# EAGLE design H1AR0 (EAGLE 9.6.1)

## Sheet 1 of 2
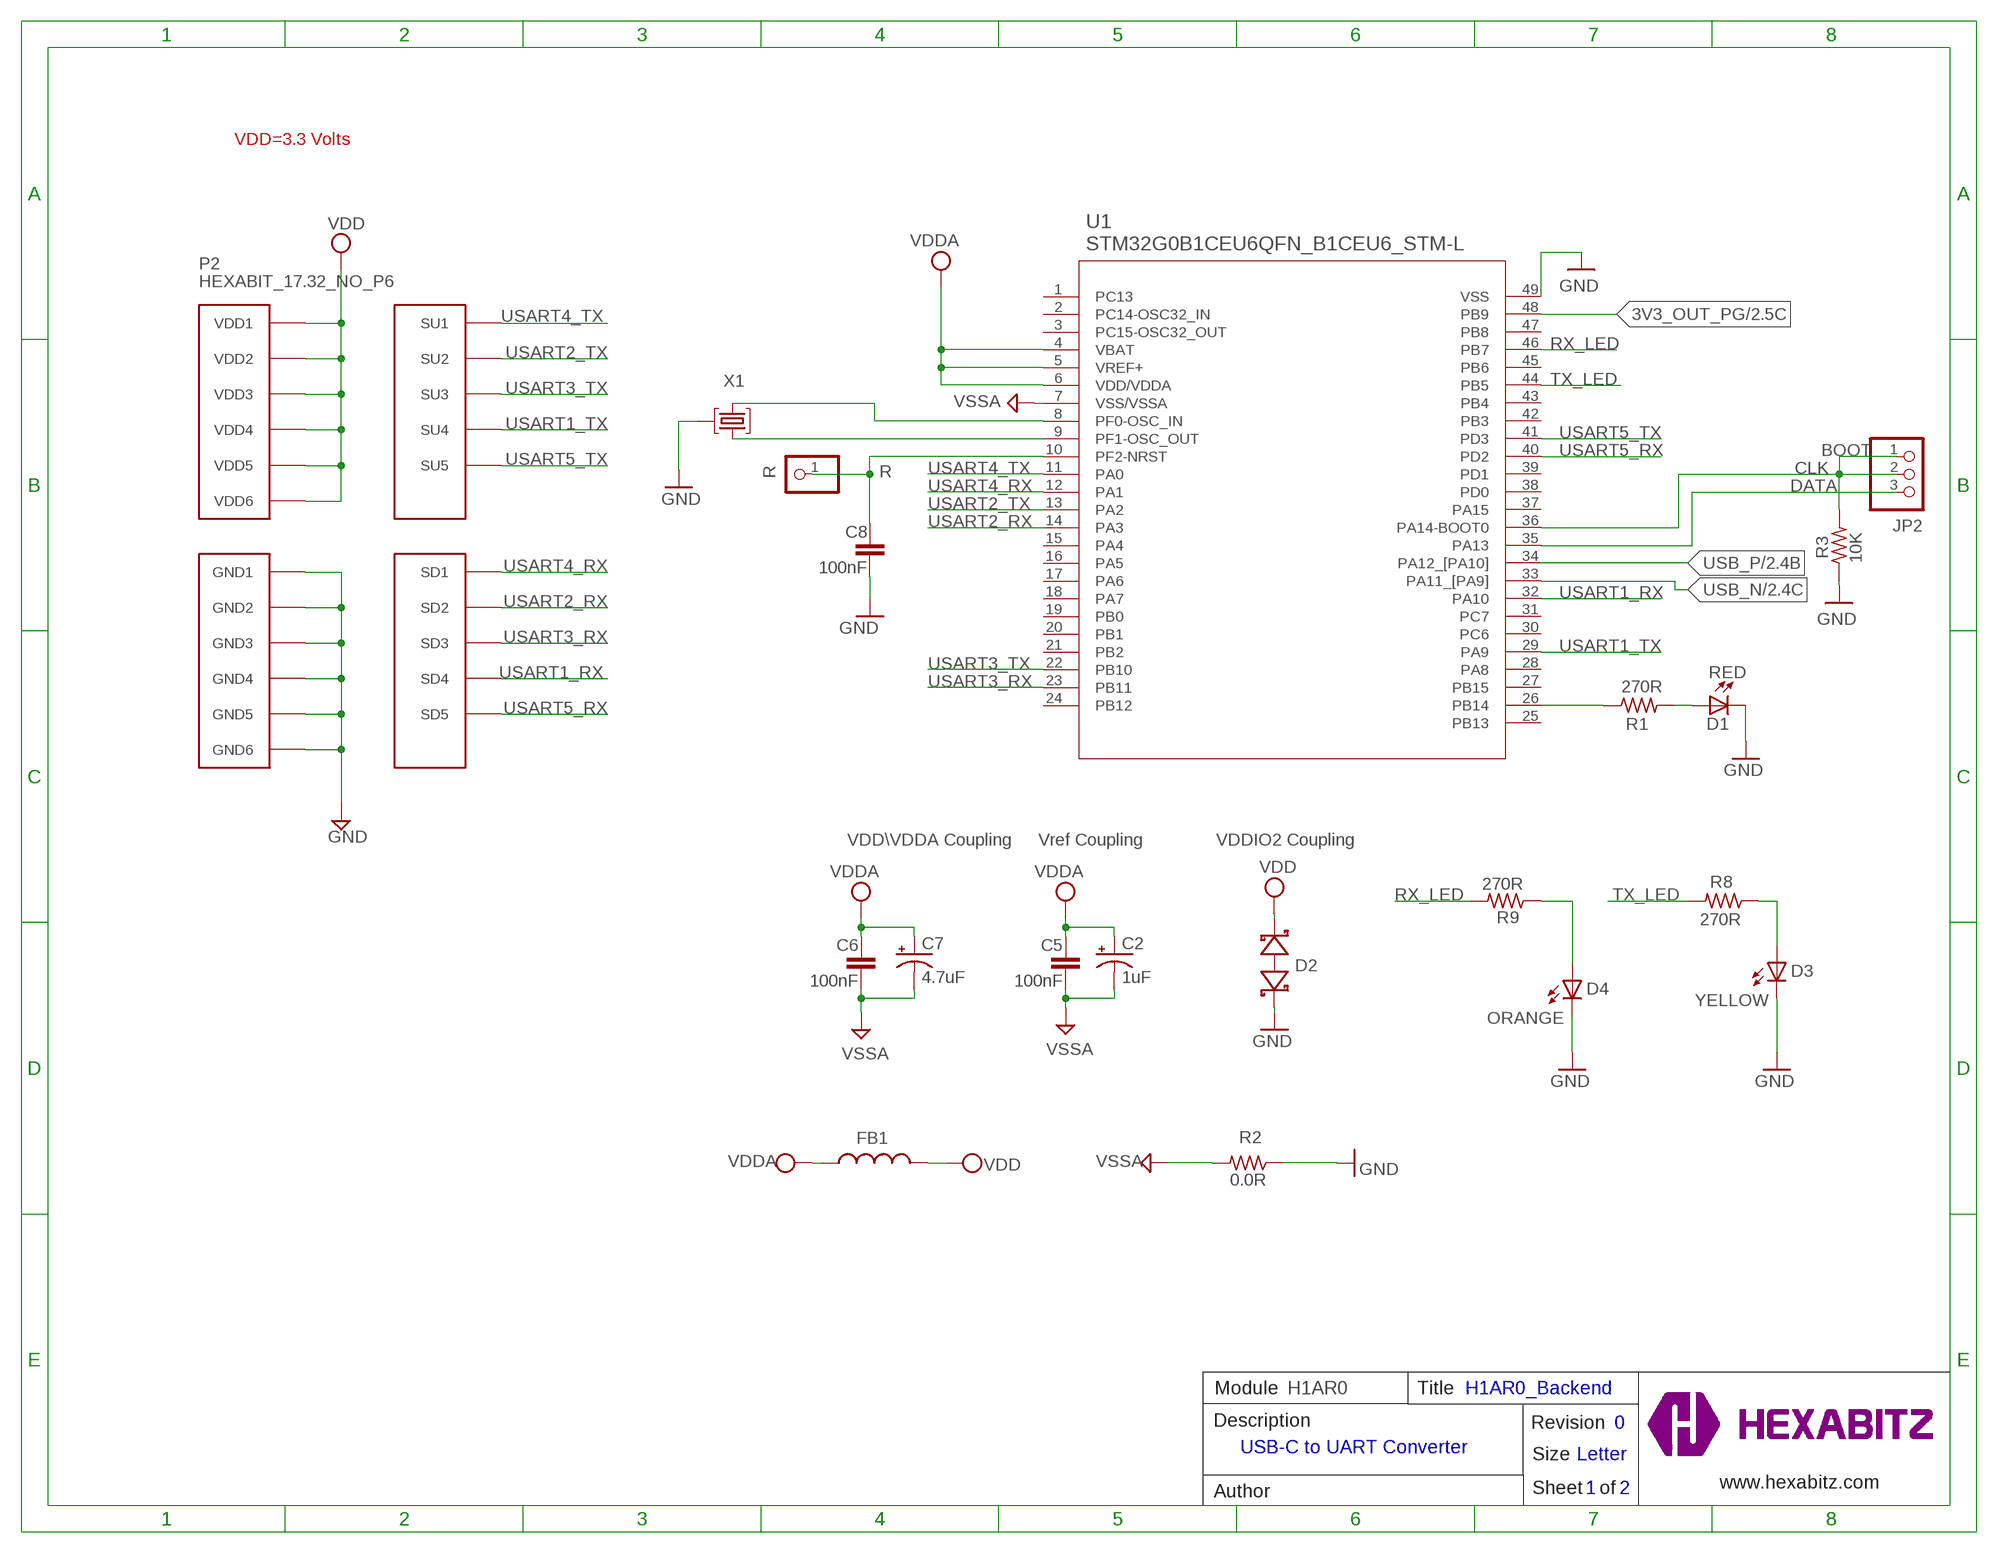
[diagram p0: schematic, sheet 1]

### Parts
C2  1uF  C-0805-POL  [C-0805-POL]
C5  100nF  C-0603  [C-0603]
C6  100nF  C-0603  [C-0603]
C7  4.7uF  C-0805-POL  [C-0805-POL]
C8  100nF  C-0603  [C-0603]
D1  RED  VLMS1300-GS08  [VLMS1300-GS08]
D2  BOURNS_CDSOD323-T03SCBOURNS_CDSOD323-T03SC_0_0  [BOURNS_CDSOD323-T03SC_0]
D3  YELLOW  VLMS1300-GS08  [VLMS1300-GS08]
D4  ORANGE  VLMS1300-GS08  [VLMS1300-GS08]
FB1  FB-TDK_MMZ1608Y300B  [FB-TDK_MMZ1608Y300B]
JP2  PINHD-1X3  [1X03]
P2  HEXABIT_17.32_NO_P6  [HEXABIT_17.32_NO_P6]
R  R  PINHD-1X1  [1X01]
R1  270R  R-0603  [R-0603]
R2  0.0R  R-0603  [R-0603]
R3  10K  R-0603  [R-0603]
R8  270R  R-0603  [R-0603]
R9  270R  R-0603  [R-0603]
TRIMBLE-LOGO1  HEXA-LOGO  [HEXA-LOGO]
U1  STM32G0B1CEU6QFN_B1CEU6_STM-L  [QFN_B1CEU6_STM-L]
X1  XTALL_CSTCE8M00G52  [XTALL_CSTCE8M00G52]

### Nets
3V3_OUT_PG: U1.48(PB9) ; also sheet 2
CLK: JP2.1 JP2.2 R3.2 U1.36(PA14-BOOT0)
DATA: JP2.3 U1.35(PA13)
GND: C8.2 D1.C D2.1(A) D3.C D4.C P2.PAD_PD7(GND1) P2.PAD_PD8(GND2) P2.PAD_PD9(GND3) P2.PAD_PD10(GND4) P2.PAD_PD11(GND5) P2.PAD_PD12(GND6) R2.1 R3.1 U1.49(VSS) X1.P$2 ; also sheet 2
N$2: R1.1 U1.26(PB14)
N$3: D1.A R1.2
N$4: C8.1 R.1 U1.10(PF2-NRST)
N$5: U1.9(PF1-OSC_OUT) X1.P$1
N$6: U1.8(PF0-OSC_IN) X1.P$3
N$12: D4.A R9.1
N$13: D3.A R8.1
RX_LED: R9.2 U1.46(PB7)
TX_LED: R8.2 U1.44(PB5)
USART1_RX: P2.PAD_PD4(SD4) U1.32(PA10)
USART1_TX: P2.PAD_PU4(SU4) U1.29(PA9)
USART2_RX: P2.PAD_PD2(SD2) U1.14(PA3)
USART2_TX: P2.PAD_PU2(SU2) U1.13(PA2)
USART3_RX: P2.PAD_PD3(SD3) U1.23(PB11)
USART3_TX: P2.PAD_PU3(SU3) U1.22(PB10)
USART4_RX: P2.PAD_PD1(SD1) U1.12(PA1)
USART4_TX: P2.PAD_PU1(SU1) U1.11(PA0)
USART5_RX: P2.PAD_PD5(SD5) U1.40(PD2)
USART5_TX: P2.PAD_PU5(SU5) U1.41(PD3)
USB_N: U1.33(PA11_[PA9]) ; also sheet 2
USB_P: U1.34(PA12_[PA10]) ; also sheet 2
VDD: D2.2(C) FB1.2 P2.PAD_PU7(VDD1) P2.PAD_PU8(VDD2) P2.PAD_PU9(VDD3) P2.PAD_PU10(VDD4) P2.PAD_PU11(VDD5) P2.PAD_PU12(VDD6) ; also sheet 2
VDDA: C2.1(+) C5.1 C6.1 C7.1(+) FB1.1 U1.4(VBAT) U1.5(VREF+) U1.6(VDD/VDDA)
VSSA: C2.2(-) C5.2 C6.2 C7.2(-) R2.2 U1.7(VSS/VSSA)
Unconnected: U1.1(PC13) U1.2(PC14-OSC32_IN) U1.3(PC15-OSC32_OUT) U1.15(PA4) U1.16(PA5) U1.17(PA6) U1.18(PA7) U1.19(PB0) U1.20(PB1) U1.21(PB2) U1.24(PB12) U1.25(PB13) U1.27(PB15) U1.28(PA8) U1.30(PC6) U1.31(PC7) U1.37(PA15) U1.38(PD0) U1.39(PD1) U1.42(PB3) U1.43(PB4) U1.45(PB6) U1.47(PB8)

### Notes on the sheet
- VDD=3.3 Volts
- BOOT
- VDD\VDDA Coupling | Vref Coupling | VDDIO2 Coupling
- Module | H1AR0 | Title | H1AR0_Backend
- Description | Revision | 0
- USB-C to UART Converter
- Size | Letter
- www.hexabitz.com
- Author | Sheet   of | 1 | 2
- C:/Users/Admin/Desktop/logodraft.bmp

## Sheet 2 of 2
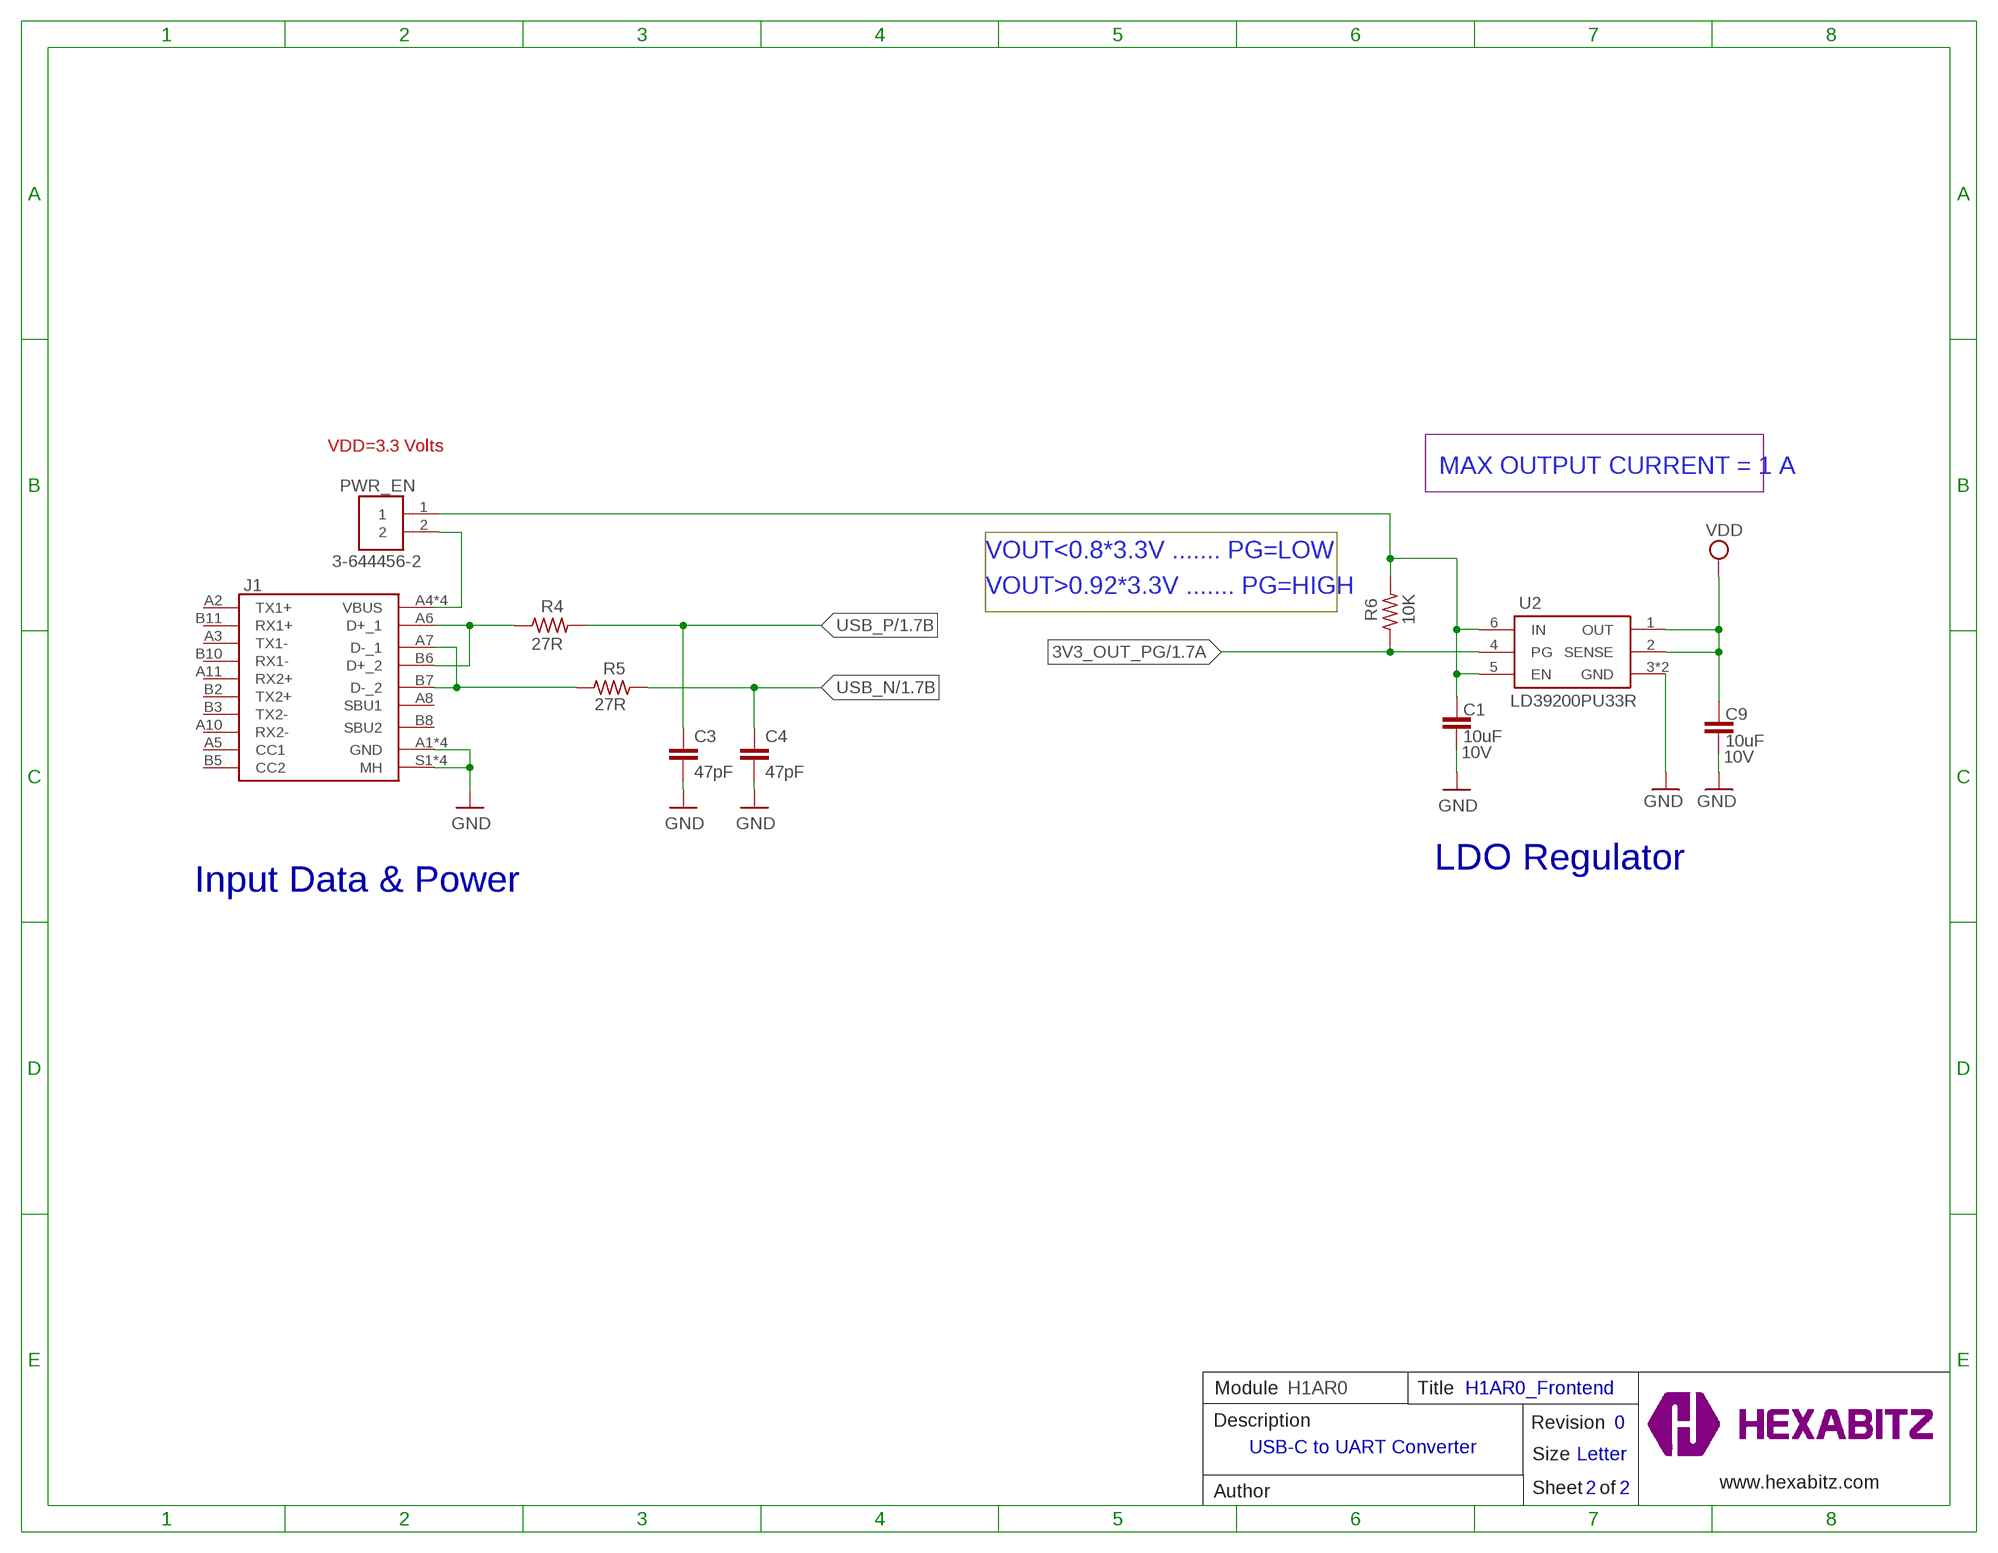
[diagram p1: schematic, sheet 2]

### Parts
C1  10uF  C-0805  [C-0805]
C3  47pF  C-0603  [C-0603]
C4  47pF  C-0603  [C-0603]
C9  10uF  C-0805  [C-0805]
J1  12401610E4#2A12401610E42A  [AMPHENOL_12401610E4_2A]
PWR_EN  3-644456-2  [TE_3-644456-2]
R4  27R  R-0603  [R-0603]
R5  27R  R-0603  [R-0603]
R6  10K  R-0603  [R-0603]
U2  LD39200PU33R  [SON95P300X300X100-7N]

### Nets
3V3_OUT_PG: R6.1 U2.4(PG) ; also sheet 1
D_N: J1.A7(D-_1) J1.B7(D-_2) R5.2
D_P: J1.A6(D+_1) J1.B6(D+_2) R4.1
GND: C1.1 C3.2 C4.2 C9.1 J1.A1(GND) J1.A12(GND) J1.B1(GND) J1.B12(GND) J1.S1(MH) J1.S2(MH) J1.S3(MH) J1.S4(MH) U2.3(GND) U2.7(GND) ; also sheet 1
N$1: C1.2 PWR_EN.1 R6.2 U2.5(EN) U2.6(IN)
N$8: J1.A4(VBUS) J1.A9(VBUS) J1.B4(VBUS) J1.B9(VBUS) PWR_EN.2
USB_N: C4.1 R5.1 ; also sheet 1
USB_P: C3.1 R4.2 ; also sheet 1
VDD: C9.2 U2.1(OUT) U2.2(SENSE) ; also sheet 1
Unconnected: J1.A2(TX1+) J1.A3(TX1-) J1.A5(CC1) J1.A8(SBU1) J1.A10(RX2-) J1.A11(RX2+) J1.B2(TX2+) J1.B3(TX2-) J1.B5(CC2) J1.B8(SBU2) J1.B10(RX1-) J1.B11(RX1+)

### Notes on the sheet
- VDD=3.3 Volts
- MAX OUTPUT CURRENT = 1 A
- VOUT<0.8*3.3V ....... PG=LOW
- VOUT>0.92*3.3V ....... PG=HIGH
- LDO Regulator
- Input Data & Power
- Module | H1AR0 | Title | H1AR0_Frontend
- Description | Revision | 0
- USB-C to UART Converter
- Size | Letter
- www.hexabitz.com
- Author | Sheet   of | 2 | 2

## Library data of the parts
C1 C9 = HEXABITZ_RCLS:C-0805: CAP CER 10% X7R 0805; MPN: GRM187R61A226ME15; VOLTAGE_RATING: 10V
C2 C7 = HEXABITZ_RCLS:C-0805-POL: Cap Tant Solid SMD 2012
C3-C6 C8 = HEXABITZ_RCLS:C-0603: CAP CER 10% X7R 0603
D1 = Hexabitz:VLMS1300-GS08: Red 0603 130° Clear 54 mcd 2 V Surface Mount ChipLED ; Octopart Url : http://octopart.com/vlms1300-gs08-vishay-21709201; MFN: Vishay; MPN: VLMS1300-GS08; OCTOPART_URL: https://octopart.com/vlms1300-gs08-vishay-21709201?r=sp&s=_gcP4_q8T1SC6PJQPTQ9yA
D2 = HEXABITZ_RCLS:BOURNS_CDSOD323-T03SC: CDSOD323-TxxSC - TVS Diode Series; DESCRIPTION: Dio Tvs Vwm 03V 500W Bidir Sod323 / Tape & Reel - 7" Reel; MFN: Bourns; MPN: CDSOD323-T03SC; OCTOPART_URL: https://octopart.com/cdsod323-t03sc-bourns-10487153?r=sp
D3 D4 = HEXABITZ_USER_INTERFACE_PARTS:VLMS1300-GS08: Red 0603 130° Clear 54 mcd 2 V Surface Mount ChipLED ; Octopart Url : http://octopart.com/vlms1300-gs08-vishay-21709201; MFN: Vishay; MPN: VLMS1300-GS08; OCTOPART_URL: https://octopart.com/vlms1300-gs08-vishay-21709201?r=sp&s=_gcP4_q8T1SC6PJQPTQ9yA; VALUE: RED
FB1 = HEXABITZ_RCLS:FB-TDK_MMZ1608Y300B: Ferrite Beads Multi-Layer 30Ohm 25% 100MHz 1.5A 50mOhm DCR 0603; MFN: TDK; MPN: MMZ1608Y300B; OCTOPART_URL: https://octopart.com/mmz1608y300b-tdk-368280?r=sp&s=cd9_2ZEqQ9q9UNBuQgHAiA
J1 = HEXABITZ_CONNECTION_PARTS:12401610E4#2A: USB3.2 GEN2, Type C, Top mount, CH 1.58mm, Dual Row SMT Source: Datasheet <https://cdn.amphenol-cs.com/media/wysiwyg/files/drawing/c12401610_c.pdf>
JP2 = pinhead:PINHD-1X3: PIN HEADER
P2 = hexabitz_connectors:HEXABIT_?_NO_P6: Hexabitz Hexagon Module Connector Hexagon side length = 17.32mm. The following ports are removed: P6
PWR_EN = HEXABITZ_USER_INTERFACE_PARTS:3-644456-2; AVAILABILITY: Unavailable; CENTERLINE_PITCH: 2.54 mm[.1 in]; COMMENT: 3-644456-2; DESCRIPTION: Connector Unshrouded Header HDR 2 Position 2.54mm Solder Straight Thru-Hole; EU_ROHS_COMPLIANCE: Compliant; MF: TE Connectivity; MFN: TE Connectivity; MP: 3-644456-2; MPN: 87224-1; NUMBER_OF_POSITIONS: 2; OCTOPART_URL: https://octopart.com/87224-1-te+connectivity-39512011?r=sp; PACKAGE: None; PRICE: None; PRODUCT_TYPE: Connector; TE_PURCHASE_URL: https://www.te.com/usa-en/product-3-644456-2.html?te_bu=Cor&te_type=disp&te_campaign=seda_glo_cor-seda-global-disp-prtnr-fy19-seda-model-bom-cta_sma-317_1&elqCampaignId=32493
R = HEXABITZ_USER_INTERFACE_PARTS:PINHD-1X1: PIN HEADER; MFN: TE Connectivity; MPN: 87227-1; OCTOPART_URL: https://octopart.com/87227-1-te+connectivity-39512052?r=sp
R1 R3 R8 R9 = HEXABITZ_RCLS:R-0603: Thick Film Resistors - SMD 0603
R2 = HEXABITZ_RCLS:R-0603: Thick Film Resistors - SMD 0603; MFN: Yageo; MPN: RC0603JR-070RL; OCTOPART_URL: https://octopart.com/rc0603jr-070rl-yageo-1241539?r=sp&s=X2NteqRjRNWrnx42Y0aliA; RESISTANCE: 0.0 Ohm
R4-R6 = HEXABITZ_RCLS:R-0603: Thick Film Resistors - SMD 0603; TOLERANCE: 1%
TRIMBLE-LOGO1 = HEXABITZ_USER_INTERFACE_PARTS:HEXA-LOGO: Trimble-Logo
U1 = HEXABITZ_ICs:STM32G0B1CEU6; COPYRIGHT: Copyright (C) 2021 Ultra Librarian. All rights reserved.; MANUFACTURER_PART_NUMBER: STM32G0B1CEU6; MFR_NAME: STMicroelectronics
U2 = HEXABITZ_ICs:LD39200PU33R: LDO Voltage Regulators 2 A high PSRR ultra low drop linear regulator with reverse current protection Source: Datasheet <https://www.st.com/resource/en/datasheet/ld39200.pdf>; DESCRIPTION: LDO Voltage Regulators 2 A high PSRR ultra low drop linear regulator with reverse current protection; HEIGHT: 1mm; MANUFACTURER_NAME: STMicroelectronics; MANUFACTURER_PART_NUMBER: LD39200PU33R; MOUSER_PART_NUMBER: 511-LD39200PU33R; MOUSER_PRICE-STOCK: https://www.mouser.co.uk/ProductDetail/STMicroelectronics/LD39200PU33R?qs=WHlX%252B%252B9%2FRwAl6%2FJDqRS1uw%3D%3D
X1 = Hexabitz:XTALL_CSTCE8M00G52: MURATA CSTCE8M00G52-R0 RESONATOR, SMD, 8MHZ ; Octopart Url : https://octopart.com/cstce8m00g52-r0-murata-7145559; MFN: Murata; MPN: CSTCE8M00G52Z-R0; OCTOPART_URL: https://octopart.com/cstce8m00g52z-r0-murata-17755941?r=sp&s=JDnNJnrHQhyS8Zk4ofFWXw

## Board
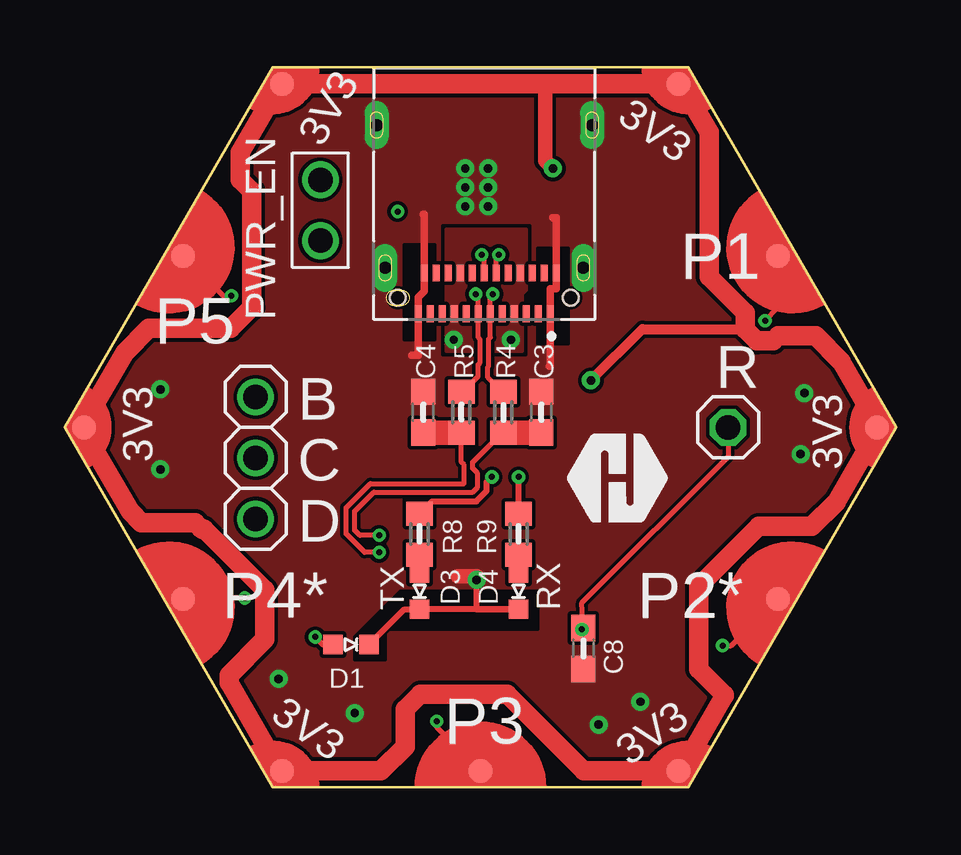
[diagram p2: board, top side]
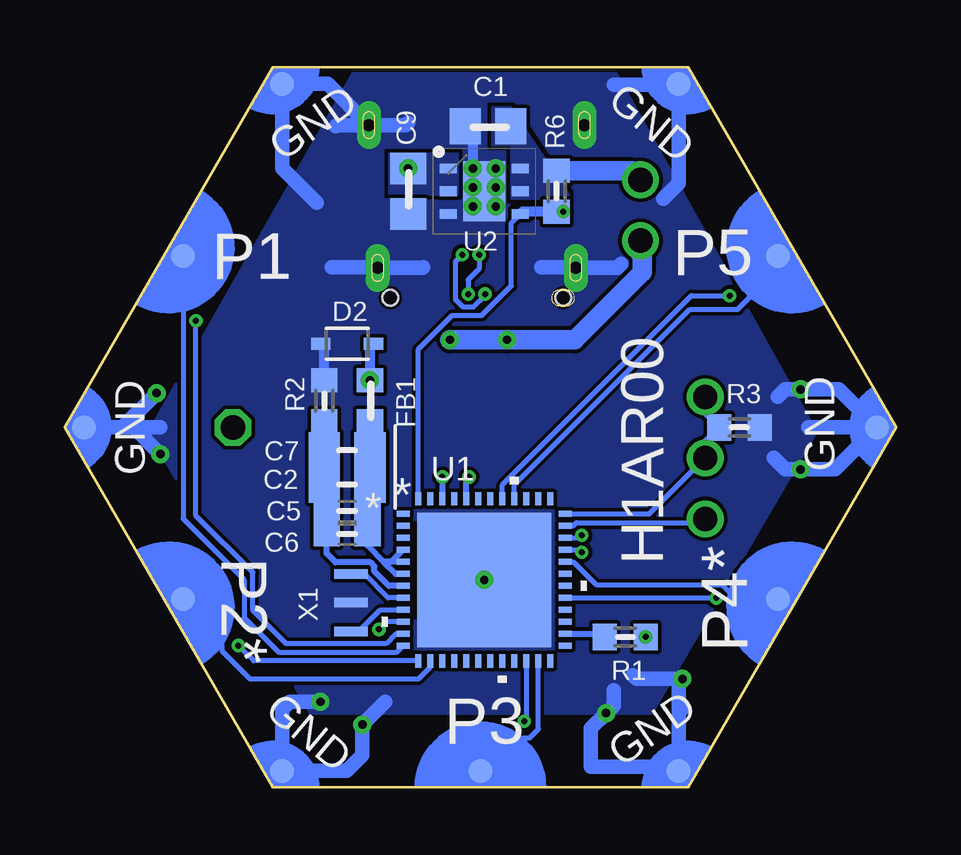
[diagram p3: board, bottom side, seen from below]

Size 34.64 x 30 mm. Coordinates in mm from the lower left corner, seen from the top.
Copper layers (1*16): Top 0.035mm / dielectric 1.5mm / Bottom 0.035mm
Design rules "default *": minimum track width 6mil, minimum drill 0.25mm, track to track 6mil, track to pad 6mil, pad to pad 6mil, via to via 6mil, smd to smd 0mil, copper to edge 0.15mm, drill to drill 1mil, minimum pad ring 10mil, minimum via ring 6mil, stop-mask expansion 4mil, vias tented up to drill 25mil, thermal gap 10mil

### Footprints (pad centres in the part's own frame; a part is rotated, then mirrored left to right if it is on the bottom)
C-0805 = smd 1.3 x 1.5: 1 -0.95,0; 2 0.95,0
C-0805-POL = smd 1.3 x 1.5: 1 -0.95,0; 2 0.95,0
C-0603 = smd 1.1 x 1: 1 -0.85,0; 2 0.85,0
VLMS1300-GS08 = smd 0.8 x 0.8: A 0,0.75; C 0,-0.75
BOURNS_CDSOD323-T03SC_0 = smd 0.8 x 0.5: 1 -1.1,0; 2 1.1,0
FB-TDK_MMZ1608Y300B = smd 1 x 1.1: 1 -0.85,0; 2 0.85,0
AMPHENOL_12401610E4_2A = smd 0.29 x 0.7: A1 -2.75,0.66; A2 -2.25,0.66; A3 -1.75,0.66; A4 -1.25,0.66; A5 -0.75,0.66; A6 -0.25,0.66; A7 0.25,0.66; A8 0.75,0.66; A9 1.25,0.66; A10 1.75,0.66; A11 2.25,0.66; A12 2.75,0.66; B1 2.5,-1.04; B2 2,-1.04; B3 1.5,-1.04; B4 1,-1.04; B5 0.5,-1.04; B6 0,-1.04; B7 -0.5,-1.04; B8 -1,-1.04; B9 -1.5,-1.04; B10 -2,-1.04; B11 -2.5,-1.04; B12 -3,-1.04 | drill 0.5 pad 0.8 long: S1 -4.13,-1.25; S2 4.13,-1.25; S3 4.49,-7.2; S4 -4.49,-7.2 | hole 0.65: -3.6,0; 3.6,0
1X03 = drill 1.016: 1 -2.54,0; 2 0,0; 3 2.54,0
HEXABIT_17.32_NO_P6 = smd 1 x 1 bottom: PAD_PD1 12.39,7.15; PAD_PD2 12.39,-7.15; PAD_PD3 0,-14.31; PAD_PD4 -12.39,-7.15; PAD_PD5 -12.39,7.15; PAD_PD7 8.26,14.31; PAD_PD8 16.52,0; PAD_PD9 8.26,-14.31; PAD_PD10 -8.26,-14.31; PAD_PD11 -16.52,0; PAD_PD12 -8.26,14.31 | smd 1 x 1: PAD_PU1 12.39,7.15; PAD_PU2 12.39,-7.15; PAD_PU3 0,-14.31; PAD_PU4 -12.39,-7.15; PAD_PU5 -12.39,7.15; PAD_PU7 8.26,14.31; PAD_PU8 16.52,0; PAD_PU9 8.26,-14.31; PAD_PU10 -8.26,-14.31; PAD_PU11 -16.52,0; PAD_PU12 -8.26,14.31
TE_3-644456-2 = drill 1.02 pad 1.37: 1 0,0; 2 2.54,0
1X01 = drill 1.016 octagon: 1 0,0
R-0603 = smd 1 x 1.1: 1 -0.85,0; 2 0.85,0
QFN_B1CEU6_STM-L = smd 0.55 x 0.254: 1 -3.38,2.751; 2 -3.38,2.251; 3 -3.38,1.75; 4 -3.38,1.25; 5 -3.38,0.75; 6 -3.38,0.25; 7 -3.38,-0.25; 8 -3.38,-0.75; 9 -3.38,-1.25; 10 -3.38,-1.75; 11 -3.38,-2.251; 12 -3.38,-2.751; 25 3.38,-2.751; 26 3.38,-2.251; 27 3.38,-1.75; 28 3.38,-1.25; 29 3.38,-0.75; 30 3.38,-0.25; 31 3.38,0.25; 32 3.38,0.75; 33 3.38,1.25; 34 3.38,1.75; 35 3.38,2.251; 36 3.38,2.751 | smd 0.254 x 0.55: 13 -2.751,-3.38; 14 -2.251,-3.38; 15 -1.75,-3.38; 16 -1.25,-3.38; 17 -0.75,-3.38; 18 -0.25,-3.38; 19 0.25,-3.38; 20 0.75,-3.38; 21 1.25,-3.38; 22 1.75,-3.38; 23 2.251,-3.38; 24 2.751,-3.38; 37 2.751,3.38; 38 2.251,3.38; 39 1.75,3.38; 40 1.25,3.38; 41 0.75,3.38; 42 0.25,3.38; 43 -0.25,3.38; 44 -0.75,3.38; 45 -1.25,3.38; 46 -1.75,3.38; 47 -2.251,3.38; 48 -2.751,3.38 | smd 5.6 x 5.6: 49 0,0
SON95P300X300X100-7N = smd 0.7 x 0.4: 1 -1.5,0.95; 2 -1.5,0; 3 -1.5,-0.95; 4 1.5,-0.95; 5 1.5,0; 6 1.5,0.95 | smd 1.75 x 2.5: 7 0,0
XTALL_CSTCE8M00G52 = smd 1.4 x 0.4: P$1 0,1.2; P$2 0,0; P$3 0,-1.2

### Placement (x,y rotation side)
C1  17,27.54 0 bottom
C2  22.88,12.62 180 bottom
C3  19.86,15.63 90 top
C4  14.94,15.63 90 top
C5  22.88,11.51 180 bottom
C6  22.88,10.55 180 bottom
C7  22.88,14.05 180 bottom
C8  21.61,5.79 270 top
C9  20.34,24.84 90 bottom
D1  11.92,5.95 90 top
D2  22.88,18.49 0 bottom
D3  14.78,8.17 0 top
D4  18.91,8.17 0 top
FB1  21.92,16.11 90 bottom
J1  17.48,20.4 180 top
JP2  7.95,13.73 270 top
P2  17.32,15 0 top
PWR_EN  10.65,25.32 270 top
R  27.64,15 0 top
R1  11.29,6.27 0 bottom
R2  23.83,16.11 270 bottom
R3  6.53,15 180 bottom
R4  18.27,15.63 270 top
R5  16.53,15.63 90 top
R6  14.14,24.84 90 bottom
R8  14.78,10.55 90 top
R9  18.91,10.55 90 top
TRIMBLE-LOGO1  23.04,11.03 0 top
U1  17.16,8.65 0 bottom
U2  17.16,24.84 0 bottom
X1  22.72,7.7 180 bottom

### Tracks (layer width: path | path; a pad name or v marks a point on that pad's centre or on a via)
3V3_OUT_PG  (via drill 0.25 pad 0.55)
  Bottom 0.203: U2.4 16.03,23.52 16.03,20.9 17.26,19.67 18.51,19.67 19.91,18.26 U1.48
  Bottom 0.305: R6.1 v13.87,23.99
  Bottom 0.406: U2.4 15.56,23.99 R6.1
CLK
  Bottom 0.203: U1.36 10.28,11.4 JP2.2
  Bottom 0.254: JP2.1 7.95,15.58 R3.2 7.95,14.42 JP2.2
D_N  (via drill 0.25 pad 0.55)
  Top 0.203: R5.2 16.58,16.48 17.22,17.13 17.22,17.62 17.3,17.7 17.3,18.66 17.23,18.74 J1.A7 17.23,20.49 17.17,20.56 v17.12,20.56 | J1.B7 17.98,22.19 v18.08,22.19
  Bottom 0.203: v17.12,20.56 17.12,20.51 17.61,20.02 18.05,20.02 18.36,20.34 18.36,21.91 v18.08,22.19
D_P  (via drill 0.25 pad 0.55)
  Top 0.203: R4.1 18.22,16.48 17.63,17.07 17.63,17.53 17.66,17.55 17.66,18.68 17.73,18.75 J1.A6 17.73,20.49 17.79,20.56 v17.83,20.56 | J1.B6 17.48,22.19 v17.38,22.19
  Bottom 0.203: v17.83,20.56 17.83,21.15 17.38,21.6 v17.38,22.19
DATA
  Bottom 0.203: U1.35 13.46,10.9 13.32,11.04 8.11,11.04 JP2.3
GND  (via drill 0.35 pad 0.75)
  Top 0.254: D1.C 14.14,7.42 D3.C D4.C 17.16,7.42 17.16,8.81
  Top 0.305: 14.94,23.89 14.98,23.89 J1.B1 14.98,20.68 14.73,20.43 J1.A12 14.73,18.02 14.46,18.02 | 20.34,23.73 20.48,23.73 J1.B12 20.48,20.78 20.23,20.78 J1.A1 20.23,17.54 20.18,17.54
  Top 0.61: U1.49 17.16,8.81 16.37,8.81
  Bottom 0.406: R2.1 23.83,18.34 D2.1 | C1.1 17.64,27.23 v17.64,25.79 | U1.49 18.11,7.7
  Bottom 0.61: 31.77,15 30.66,15 | J1.S4 23.3,27.6 23.35,27.54 | J1.S4 20.44,27.6 20.34,27.7 | 23.51,21.67 21.63,21.67 J1.S1 19.72,21.65 19.7,21.67 | 14.78,21.67 13.37,21.67 J1.S2 11.62,21.65 11.45,21.83 | 11.76,29.29 9.08,29.29 P2.PAD_PD12 9.06,25.18 9.71,24.53 | P2.PAD_PD11 3.67,15 | 9.06,3.1 P2.PAD_PD10 9.24,0.87 12.72,0.87 12.72,2.46 v12.08,3.09 11.76,3.41 11.76,4.05 | 9.06,3.1 8.91,3.25 | 21.29,3.57 v22.24,2.62 22.24,1.35 22.9,0.69 P2.PAD_PD9 25.58,3.25 25.26,3.57 v23.99,3.57 | 32.24,15 31.77,15 | 31.77,15 v30.66,13.89 | P2.PAD_PD8 32.24,15 | 32.24,15 v30.81,16.43 | 9.06,3.1 9.06,4.37 v8.91,4.52 10.81,4.52 10.97,4.68 | J1.S4 23.68,29.31 P2.PAD_PD7 25.58,25.8 24.15,24.37 | P2.PAD_PD11 2.39,16.59 v3.98,16.59 4.62,16.59 4.94,16.27 | 5.1,13.73 4.62,13.25 v3.98,13.25 2.55,13.25 P2.PAD_PD11
  other vias: 16.68,25.79 17.64,25 16.68,25 16.68,24.21 17.64,24.21 17.16,8.65
  pour Bottom (rank 2, no thermals): 3.35,14.82 11.85,30.04 22.46,30.04 31.12,14.81 24.39,3.09 10.21,3.09
  pour Top (rank 2, no thermals): 0.25,14.86 8.65,29.92 25.98,29.92 34.59,14.77 26,0.08 8.58,0.08
  cutout Top: 20.97,18.49 19.7,18.49 19.7,22.46 20.97,22.46
  cutout Top: 15.42,18.65 14.14,18.65 14.14,22.62 15.42,22.62
  cutout Top: 19.7,8.17 19.7,6.59 13.51,6.59 13.35,6.43 13.35,5.32 12.08,5.32 12.08,6.27 13.99,8.17
GND1
  cutout Bottom: 18.91,7.06 20.18,7.06 20.18,11.03 18.91,11.03
N$1
  Bottom 0.813: PWR_EN.1 11.03,25.69 R6.2
  pour Bottom (no thermals): 16.05,28.34 16.05,28.34 16.84,28.34 16.84,26.75 16.05,26.75 16.05,24.52 13.51,24.52
N$2
  Bottom 0.254: U1.26 12.27,6.4 R1.1
N$3  (via drill 0.25 pad 0.55)
  Top 0.254: D1.A 10.75,5.95 R1.2
  other vias: 10.44,6.27
N$4  (via drill 0.25 pad 0.55)
  Top 0.203: R.1 27.64,13.79 21.55,7.7 C8.1
  Top 0.254: C8.1 v21.55,6.59
  Bottom 0.203: U1.10 21.24,6.9 v21.55,6.59
N$5
  Bottom 0.203: U1.9 21.49,7.4 22.39,6.5 X1.P$1
N$6
  Bottom 0.203: U1.8 21.17,7.9 22.17,8.9 X1.P$3
N$8  (via drill 0.35 pad 0.75)
  Bottom 0.813: PWR_EN.2 10.65,22.25 10.58,22.18 10.58,21.47 13.4,18.65 v16.21,18.65 v18.59,18.65
  pour Top (no thermals): 15.89,23.25 15.89,18.18 19.07,18.18 19.07,20.56 19.23,20.71 19.23,23.25
N$12
  Top 0.254: R9.1 D4.A
N$13
  Top 0.254: R8.1 D3.A
RX_LED  (via drill 0.25 pad 0.55)
  Top 0.254: R9.2 v18.91,12.94
  Bottom 0.254: v18.91,12.94 v18.91,12.93 U1.46
TX_LED  (via drill 0.25 pad 0.55)
  Top 0.254: R8.2 15.29,11.92 17.15,11.92 17.58,12.35 17.58,12.72 v17.8,12.94
  Bottom 0.254: U1.44 17.91,12.82 v17.8,12.94
USART1_RX
  Bottom 0.203: P2.PAD_PD4 6.68,7.85 7.27,8.45 12.5,8.45 13.46,9.4 U1.32
USART1_TX  (via drill 0.25 pad 0.55)
  Top 0.203: v7.5,7.9 4.98,7.9 P2.PAD_PU4
  Bottom 0.203: U1.29 v7.5,7.9
USART2_RX
  Bottom 0.203: P2.PAD_PD2 28.1,6.24 28.1,5.69 26.93,4.52 19.9,4.52 19.41,5.01 U1.14
USART2_TX  (via drill 0.25 pad 0.55)
  Top 0.203: v27.41,5.91 27.77,5.91 P2.PAD_PU2
  Bottom 0.203: U1.13 26.77,5.27 v27.41,5.91
USART3_RX
  Bottom 0.203: P2.PAD_PD3 15.95,2.06 15.28,2.06 14.91,2.43 U1.23
USART3_TX  (via drill 0.25 pad 0.55)
  Top 0.203: v15.5,2.75 15.5,2.51 P2.PAD_PU3
  Bottom 0.203: U1.22 15.41,2.84 v15.5,2.75
USART4_RX
  Bottom 0.203: P2.PAD_PD1 29.71,11.2 27.16,8.65 27.16,7.06 25.73,5.63 20.81,5.63 U1.12
USART4_TX  (via drill 0.25 pad 0.55)
  Top 0.203: v29.18,19.44 29.71,19.98 P2.PAD_PU1
  Bottom 0.203: U1.11 20.84,6.4 21.25,5.99 25.42,5.99 26.81,7.38 26.81,8.96 29.18,11.33 v29.18,19.44
USART5_RX
  Bottom 0.203: U1.40 15.91,12.61 8.6,19.92 6.6,19.92 4.93,21.59 P2.PAD_PD5
USART5_TX  (via drill 0.25 pad 0.55)
  Top 0.203: P2.PAD_PU5 6.59,20.49 v6.94,20.49
  Bottom 0.203: U1.41 16.41,12.61 8.53,20.49 v6.94,20.49
USB_N  (via drill 0.25 pad 0.55)
  Top 0.203: v13.1,9.8 12.5,9.8 11.73,10.57 11.73,11.65 12.73,12.66 16.64,12.66 16.64,13.43 16.53,13.55 R5.1
  Top 1.016: R5.1 C4.1
  Bottom 0.203: U1.33 13.1,9.9 v13.1,9.8
USB_P  (via drill 0.25 pad 0.55)
  Top 0.203: v13.1,10.5 12.29,10.5 12.08,10.71 12.08,11.51 12.88,12.3 16.99,12.3 17.2,12.51 17.2,13.09 16.99,13.29 16.99,13.56 18.22,14.78 R4.2
  Top 1.016: R4.2 C3.1
  Bottom 0.203: U1.34 13.1,10.4 v13.1,10.5
VDD  (via drill 0.35 pad 0.75)
  Top 0.406: FB1.2 24.06,19.1 28.34,19.1
  Top 0.61: C9.2 20.02,26.11 20.02,29.31
  Top 0.813: P2.PAD_PU9 21.63,0.69 18.43,3.89 14.81,3.89 14.18,3.26 14.18,1.7 13.17,0.69 P2.PAD_PU10 8.83,0.92 6.84,4.36 6.84,4.68 8.33,6.17 8.33,8.24 5.81,10.77 5.73,10.77 5.7,10.8 5.67,10.8 5.44,11.03 3.19,11.03 2.72,11.5 0.8,14.83 P2.PAD_PU11 0.8,15.17 2.5,18.12 3.51,19.13 6.93,19.13 7.79,20 7.79,24.84 7.32,25.32 7.32,26.46 8.83,29.08 P2.PAD_PU12 20.02,29.31 P2.PAD_PU7 25.81,29.08 26.84,27.29 26.84,21.28 28.34,19.78 28.34,19.1 28.83,18.61 29.52,18.61 29.73,18.81 31.29,18.81 32.36,17.74 33.84,15.17 P2.PAD_PU8 33.84,14.83 32.14,11.88 31.13,10.87 28.91,10.87 26.41,8.37 26.41,4.93 27.48,3.86 27.48,3.81 25.81,0.92 P2.PAD_PU9
  Bottom 0.406: D2.2 21.92,18.34 FB1.2
  other vias: 21.92,16.96 20.34,25.79
  pour Bottom (no thermals): 18.27,24.68 21.13,24.68 21.13,26.43 18.27,26.43
VDDA
  Bottom 0.254: U1.6 20.85,8.9 21.34,9.39 | 21.34,9.39 22.03,10.08 C6.1 C5.1 22.03,12.52 C2.1 C7.1 FB1.1 | U1.5 21.04,9.4 | 21.04,9.4 21.33,9.4 21.34,9.39 | U1.4 21.04,9.4
VSSA
  Bottom 0.254: U1.7 21.14,8.4 21.74,9 21.74,9.21 21.9,9.38 23.35,9.38 23.73,9.75 C6.2 C5.2 23.83,11.61 C2.2 C7.2 R2.2

### Text on the board
tPlace: 3V3 | 3V3 | P1 | P5 | 3V3 | 3V3 | P4* | P2* | TX | RX | 3V3 | P3 | 3V3
bPlace: GND | GND | P5 | P1 | GND | GND | * | H1AR00 | P4* | P2* | GND | P3 | GND
tNames: B | C | D
bNames: U1